# EAGLE design led_driver (EAGLE 8.5.2)
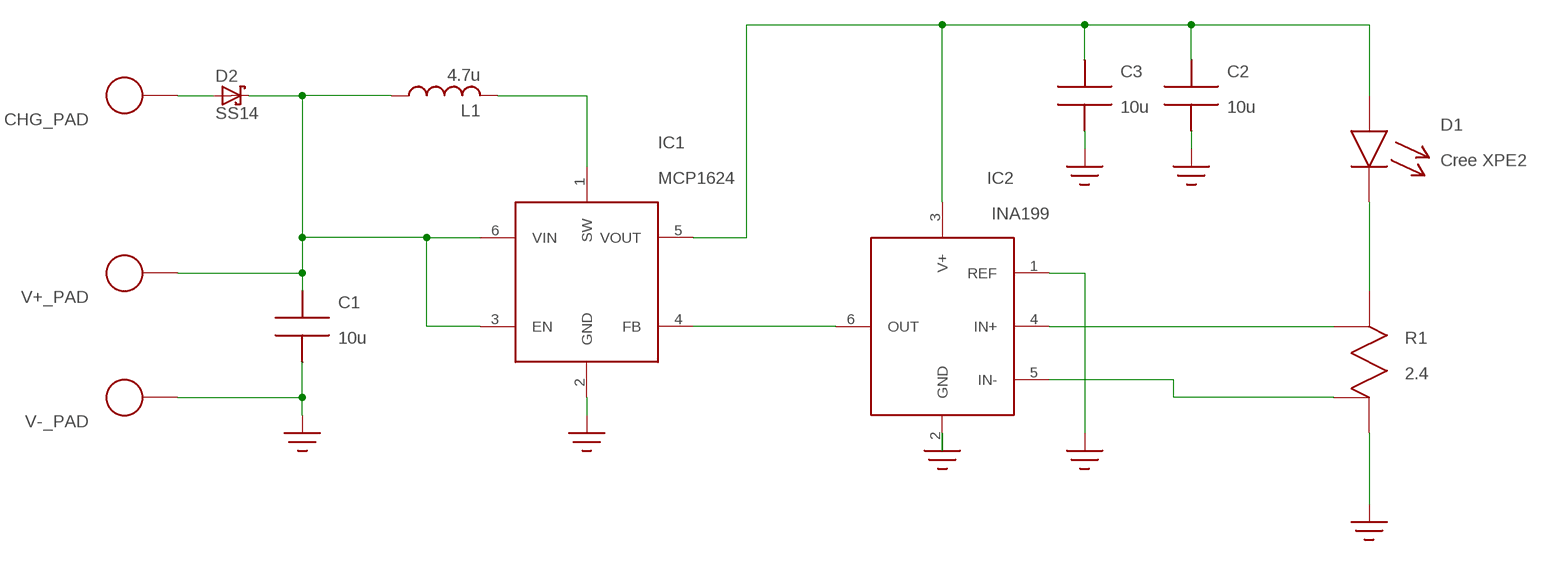
[diagram p0: schematic, sheet 1]

## Parts
C1  10u  C1206  [1206]
C2  10u  C1206  [1206]
C3  10u  C1206  [1206]
CHG_PAD  ICSP_PAD100MIL_SQUARE  [100MIL_PAD]
D1  Cree XPE2  LEDCREE_XPE  [CREE_XPE_LED]
D2  SS14  [SS14]
IC1  MCP1624  [SOT23-6]
IC2  INA199  [SC70-6]
L1  4.7u  INDUCTOR4040  [4040_INDUCTOR]
R1  2.4  R_KELVIN  [R0805_KELVIN]
V+_PAD  ICSP_PAD100MIL_SQUARE  [100MIL_PAD]
V-_PAD  ICSP_PAD100MIL_SQUARE  [100MIL_PAD]

## Nets
GND: C1.P$2 C2.P$2 C3.P$2 IC1.2(GND) IC2.1(REF) IC2.2(GND) R1.B1 V-_PAD.P$1
N$1: C1.P$1 D2.C IC1.3(EN) IC1.6(VIN) L1.P$1 V+_PAD.P$1
N$2: IC1.1(SW) L1.P$2
N$3: IC2.4(IN+) R1.A2
N$4: C2.P$1 C3.P$1 D1.A IC1.5(VOUT) IC2.3(V+)
N$5: IC1.4(FB) IC2.6(OUT)
N$6: IC2.5(IN-) R1.B2
N$7: CHG_PAD.P$1 D2.A
N$8: D1.C R1.A1

## Library data of the parts
C1-C3 = tritiled:C
CHG_PAD V+_PAD V-_PAD = tritiled:ICSP_PAD
D1 = tritiled:LED
D2 = servo_generator:SS14
IC1 = servo_generator:MCP1624
IC2 = servo_generator:INA199
L1 = servo_generator:INDUCTOR
R1 = servo_generator:R_KELVIN

## Board
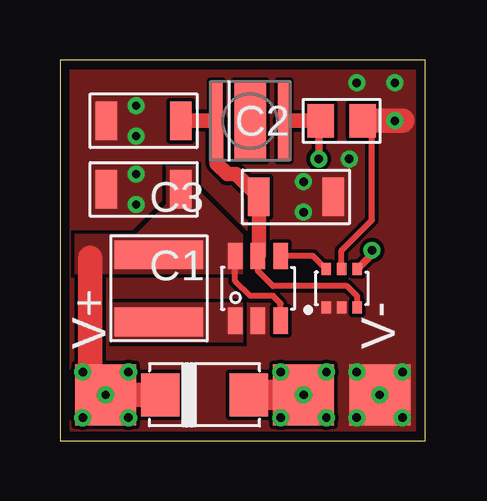
[diagram p1: board, top side]
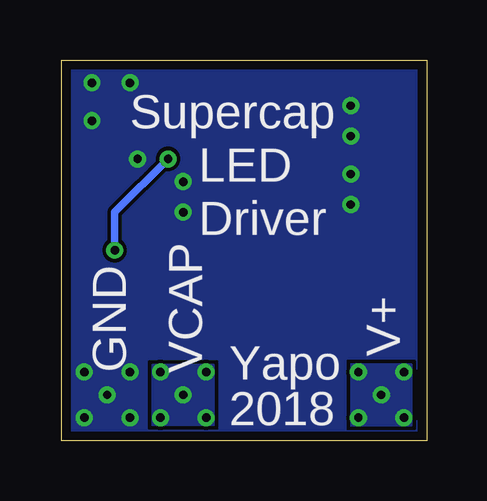
[diagram p2: board, bottom side, seen from below]

Size 15.24 x 15.88 mm. Coordinates in mm from the lower left corner, seen from the top.
Outline: 0,0 15.24,0 15.24,15.88 0,15.88 0,0
Copper layers (1*16): Top 0.0356mm / dielectric 1.5011mm / Bottom 0.0356mm
Design rules "LaenPCBOrder": minimum track width 6mil, minimum drill 13mil, track to track 6mil, track to pad 6mil, pad to pad 6mil, via to via 6mil, smd to smd 6mil, copper to edge 15mil, drill to drill 6mil, minimum pad ring 7mil, minimum via ring 7mil, stop-mask expansion 3mil, vias tented up to drill 0mil, thermal gap 10mil

### Footprints (pad centres in the part's own frame; a part is rotated, then mirrored left to right if it is on the bottom)
1206 = smd 0.9 x 1.6: P$1 -1.55,0; P$2 1.55,0
100MIL_PAD = smd 2.54 x 2.54: P$1 0,0
CREE_XPE_LED = smd 0.5 x 3.3: A -1.4,0; C 1.4,0 | smd 1.3 x 3.3: HS 0,0
SS14 = smd 1.6 x 1.8: A -1.84,0; C 1.84,0
SOT23-6 = smd 0.6 x 1.1: 1 -0.95,-1.35; 2 0,-1.35; 3 0.95,-1.35; 4 0.95,1.35; 5 0,1.35; 6 -0.95,1.35
SC70-6 = smd 0.4 x 0.5: 1 -0.65,-0.8; 2 0,-0.8; 3 0.65,-0.8; 4 0.65,0.8; 5 0,0.8; 6 -0.65,0.8
4040_INDUCTOR = smd 1.2 x 3.7: P$1 -1.4,0; P$2 1.4,0
R0805_KELVIN = smd 1.1 x 1.4: A1 -0.875,0; A2 -0.875,0; B1 0.875,0; B2 0.875,0

### Placement (x,y rotation side)
C1  3.49,10.48 180 top
C2  9.84,10.16 0 top
C3  3.49,13.34 180 top
CHG_PAD  10.16,1.91 0 top
D1  7.94,13.34 0 top
D2  6.03,1.91 180 top
IC1  8.26,6.35 0 top
IC2  11.75,6.35 0 top
L1  4.13,6.35 270 top
R1  11.75,13.34 0 top
V+_PAD  1.91,1.91 0 top
V-_PAD  13.34,1.91 0 top

### Tracks (layer width: path | path; a pad name or v marks a point on that pad's centre or on a via)
GND  (via drill 0.35)
  Top 1.016: 14.29,13.34 R1.B1
  other vias: 3.17,13.97 3.17,12.7 3.17,11.11 3.17,9.84 10.16,10.79 10.16,9.53 12.38,14.92 13.97,14.92 13.97,13.34 13.34,1.91 14.29,2.86 12.38,2.86 12.38,0.95 14.29,0.95 12.06,11.75
  pour Top (rank 2, no thermals): 0,15.88 15.24,15.88 15.24,0 0,0
  pour Bottom (rank 2): 0,15.88 15.24,15.88 15.24,0 0,0
N$1  (via drill 0.35)
  Top 0.254: IC1.3 9.21,5.71 8.89,6.03 7.94,6.03 7.3,6.67 IC1.6
  Top 1.016: D2.C V+_PAD.P$1 1.27,2.54 1.27,7.62
  other vias: 1.91,1.91 0.95,2.86 2.86,2.86 2.86,0.95 0.95,0.95
  pour Top (no thermals): 0.64,6.99 7.62,6.99 7.62,8.57 5.71,10.48 5.71,11.43 4.45,11.43 4.45,9.84 3.17,8.57 0.64,8.57
  pour Bottom (no thermals): 0.64,3.17 3.17,3.17 3.17,0.64 0.64,0.64
N$2
  pour Top (no thermals): 7.62,5.71 2.22,5.71 2.22,4.13 7.62,4.13
N$3  (via drill 0.35)
  Top 0.305: IC2.4 13.02,7.77 v13.02,7.94 | v10.79,11.75 10.79,13.26 R1.A2
  Bottom 0.305: v13.02,7.94 13.02,9.53 v10.79,11.75
N$4
  Top 0.254: IC2.3 12.4,6.02 11.98,6.44 8.89,6.44 8.26,7.07 IC1.5
  Top 0.61: IC1.5 8.29,7.74 C2.P$1 7.34,11.11 6.99,11.11 6.54,11.56 D1.A C3.P$1
N$5
  Top 0.254: IC2.6 10.55,7.7 IC1.4
N$6
  Top 0.254: IC2.5 11.75,7.94 13.02,9.21 13.02,12.94 R1.B2
N$7  (via drill 0.35)
  Top 1.27: D2.A CHG_PAD.P$1
  other vias: 10.16,1.91 9.21,2.86 11.11,2.86 11.11,0.95 9.21,0.95
  pour Bottom (no thermals): 8.89,3.17 8.89,0.64 11.43,0.64 11.43,3.17
N$8
  Top 0.61: D1.C R1.A1

### Text on the board
tPlace: V+ | V-
bPlace: Supercap | LED | Driver | VCAP | GND | V+ | Yapo | 2018